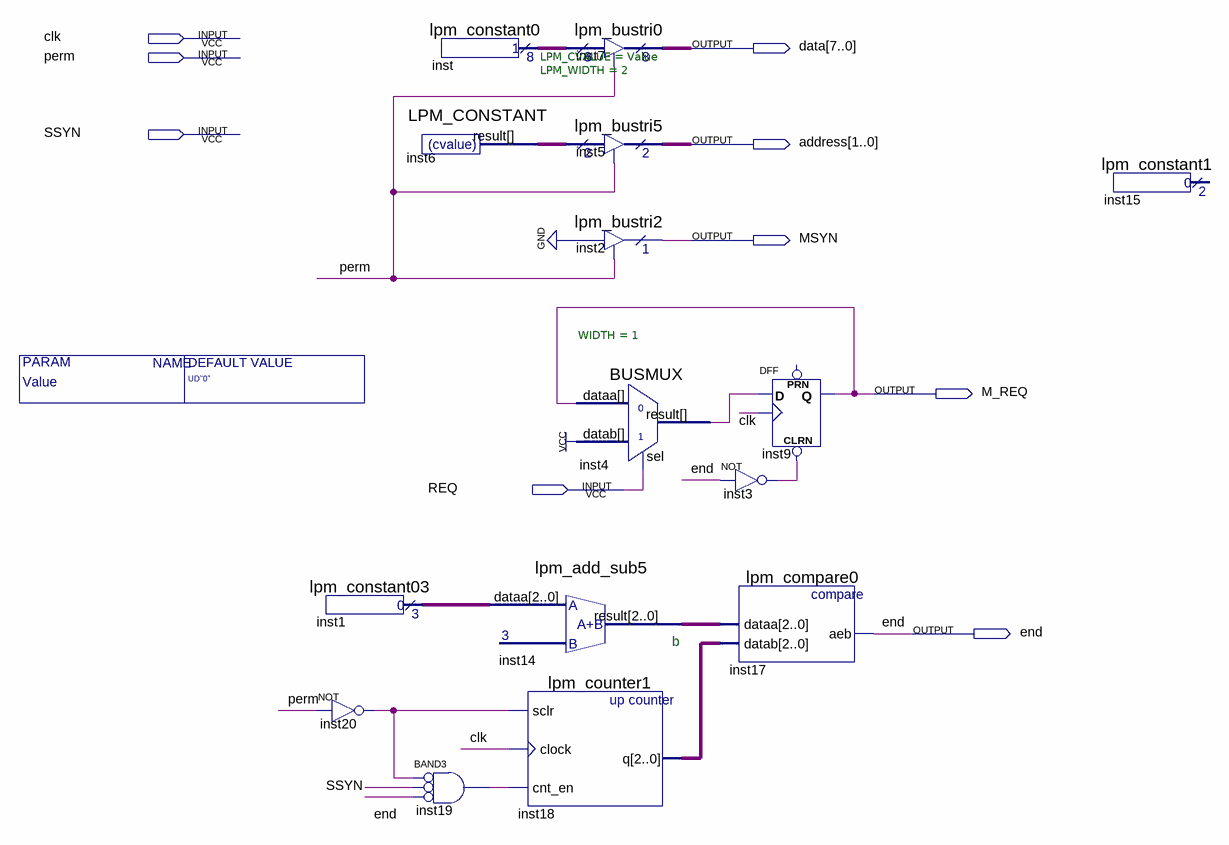
[diagram p0: schematic sheet]
// Quartus schematic Master1.bdf as structural Verilog: 15 symbols, 9 pins
module Master1 #(parameter Value = "UD\"0\"") (
  input  clk,
  input  perm,
  input  SSYN,
  input  REQ,
  output [7:0] data,
  output [1:0] address,
  output MSYN,
  output M_REQ,
  output \end 
);

  wire inst3_out, inst4_result, inst19_out, inst20_out;
  wire [1:0] inst6_result;
  wire [2:0] inst1_result, inst14_result, inst18_q;
  wire [7:0] inst_result;

  lpm_constant03 inst1 (.result(inst1_result));
  not inst20 (inst20_out, perm);
  lpm_constant0 inst (.result(inst_result));
  LPM_CONSTANT #(.LPM_CVALUE(Value), .LPM_WIDTH(2)) inst6 (.result(inst6_result));
  and inst19 (inst19_out, ~inst20_out, ~SSYN, ~\end );  // BAND3
  lpm_add_sub5 inst14 (.dataa(inst1_result), .result(inst14_result));
  lpm_counter1 inst18 (.sclr(inst20_out), .clock(clk), .cnt_en(inst19_out), .q(inst18_q));
  lpm_bustri0 inst7 (.enabledt(perm), .data(inst_result), .tridata(data));
  lpm_bustri5 inst5 (.enabledt(perm), .data(inst6_result), .tridata(address));
  lpm_bustri2 inst2 (.enabledt(perm), .data(1'b0), .tridata(MSYN));
  BUSMUX #(.WIDTH(1)) inst4 (.datab(1'b1), .sel(REQ), .dataa(M_REQ), .result(inst4_result));
  not inst3 (inst3_out, \end );
  lpm_compare0 inst17 (.dataa(inst14_result), .datab(inst18_q), .aeb(\end ));
  DFF inst9 (.CLRN(inst3_out), .CLK(clk), .D(inst4_result), .Q(M_REQ));  // open: PRN
  lpm_constant1 inst15 ();  // open: result

  // Notes on the sheet:
  //   b
endmodule
